# EAGLE design TheSchematic (EAGLE 9.3.0)
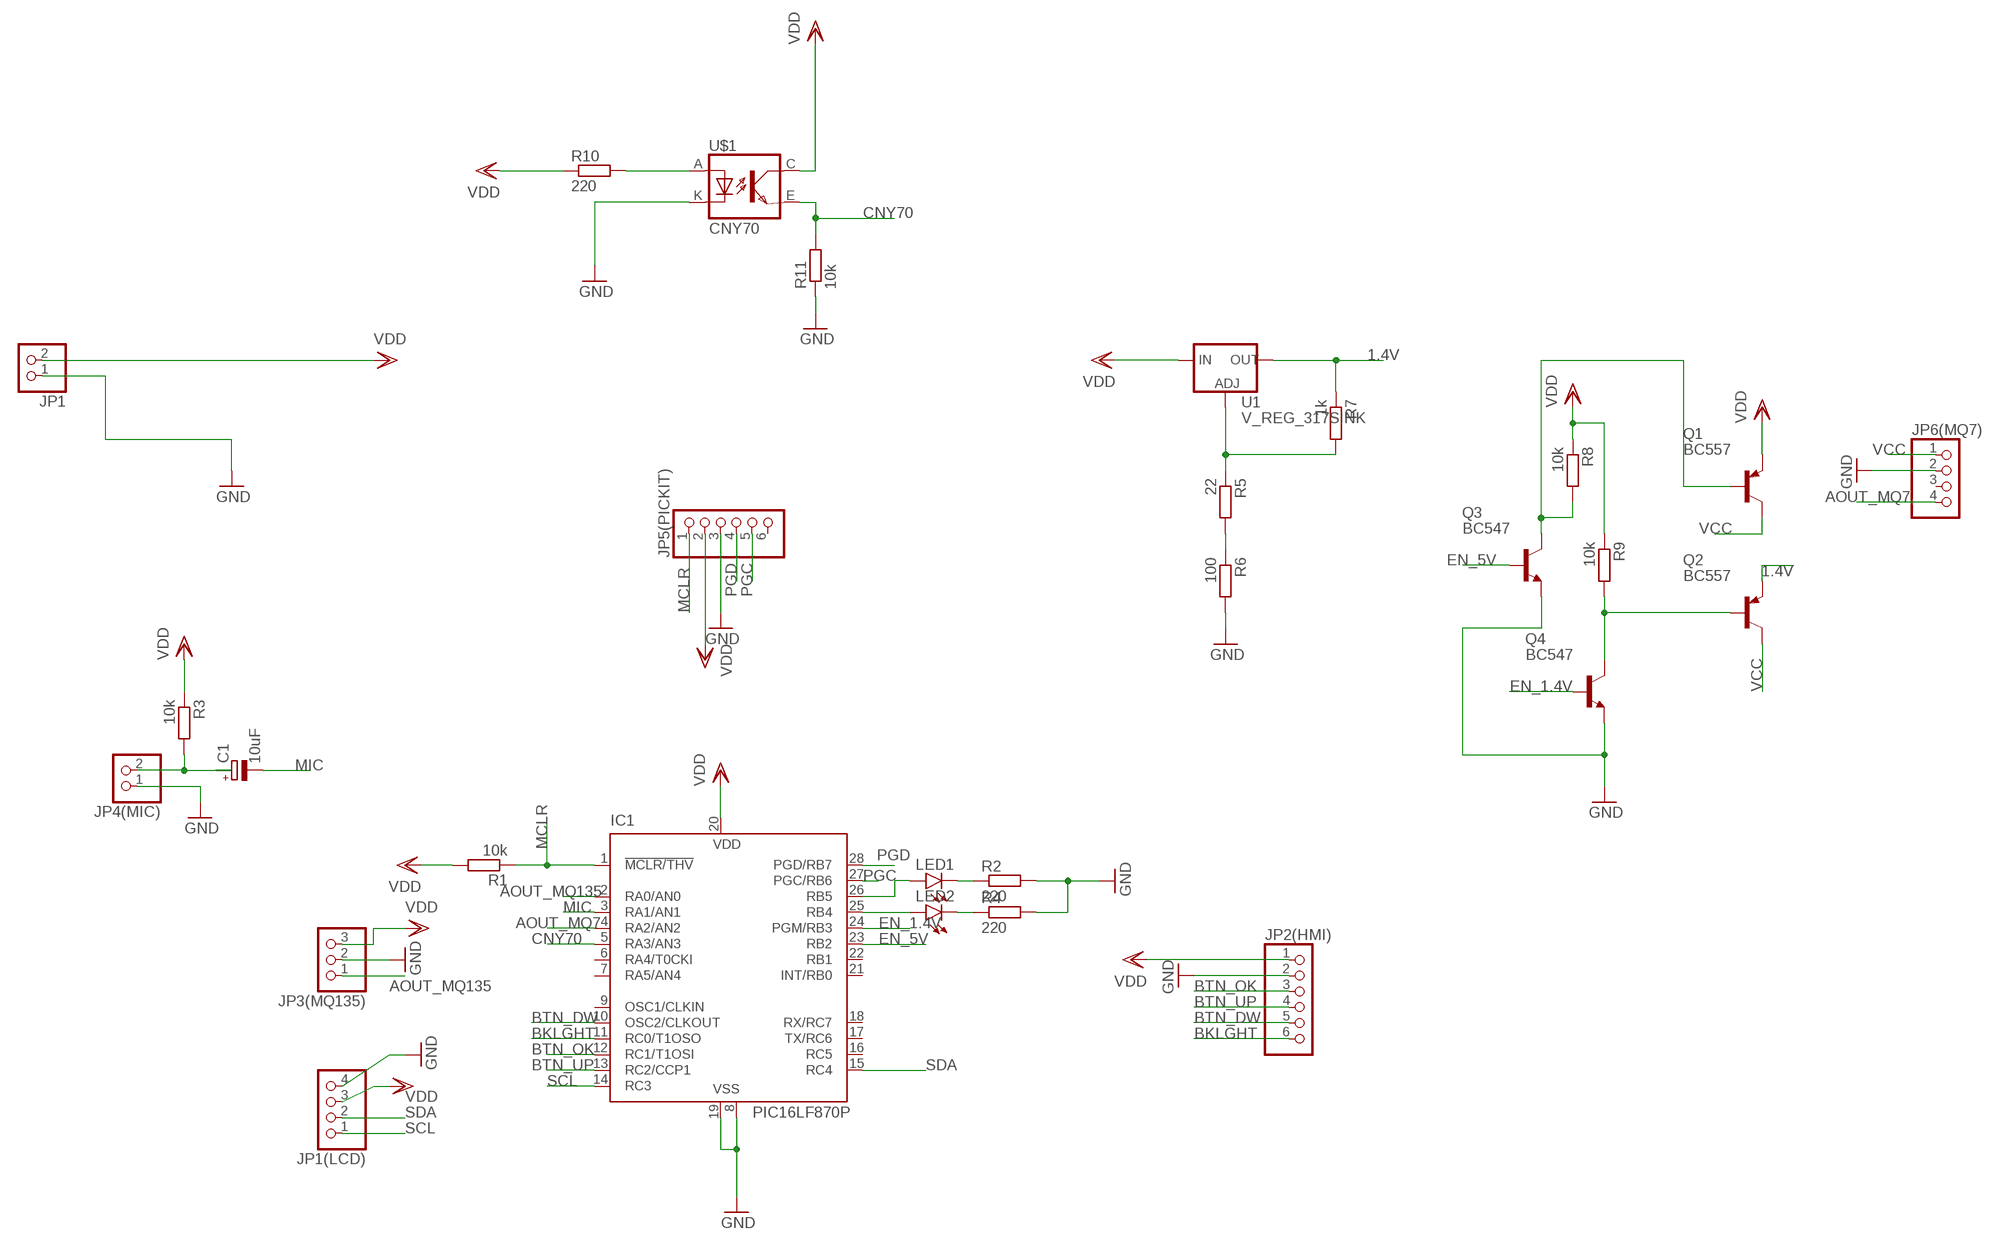
[diagram p0: schematic, sheet 1]

## Parts
C1  10uF  CPOL-EUE1.8-4  [E1,8-4]
IC1  PIC16LF870P  [DIL28-3]
JP1  PINHD-1X2  [1X02]
JP1(LCD)  PINHD-1X4  [1X04]
JP2(HMI)  PINHD-1X6  [1X06]
JP3(MQ135)  PINHD-1X3  [1X03]
JP4(MIC)  PINHD-1X2  [1X02]
JP5(PICKIT)  PINHD-1X6  [1X06]
JP6(MQ7)  PINHD-1X4  [1X04]
LED1  LED5MM  [LED5MM]
LED2  LED5MM  [LED5MM]
Q1  BC557  [TO92-EBC]
Q2  BC557  [TO92-EBC]
Q3  BC547  [TO92]
Q4  BC547  [TO92]
R1  10k  R-EU_0204/7  [0204/7]
R2  220  R-EU_0207/10  [0207/10]
R3  10k  R-EU_0204/7  [0204/7]
R4  220  R-EU_0207/10  [0207/10]
R5  22  R-EU_0204/7  [0204/7]
R6  100  R-EU_0204/7  [0204/7]
R7  1k  R-EU_0204/7  [0204/7]
R8  10k  R-EU_0204/7  [0204/7]
R9  10k  R-EU_0204/7  [0204/7]
R10  220  R-EU_0207/10  [0207/10]
R11  10k  R-EU_0207/10  [0207/10]
U1  V_REG_317SINK  [TO220-ADJ]
U$1  CNY70  [4]

## Nets
1.4V: Q2.E R7.1 U1.OUT
AOUT_MQ7: IC1.4(RA2/AN2) JP6(MQ7).4
AOUT_MQ135: IC1.2(RA0/AN0) JP3(MQ135).1
BKLGHT: IC1.11(RC0/T1OSO) JP2(HMI).6
BTN_DW: IC1.10(OSC2/CLKOUT) JP2(HMI).5
BTN_OK: IC1.12(RC1/T1OSI) JP2(HMI).3
BTN_UP: IC1.13(RC2/CCP1) JP2(HMI).4
CNY70: IC1.5(RA3/AN3) R11.2 U$1.E(EMI)
EN_1.4V: IC1.24(PGM/RB3) Q4.2(B)
EN_5V: IC1.23(RB2) Q3.2(B)
GND: IC1.8(VSS) IC1.19(VSS) JP1(LCD).4 JP1.1 JP2(HMI).2 JP3(MQ135).2 JP4(MIC).1 JP5(PICKIT).3 JP6(MQ7).2 Q3.1(E) Q4.1(E) R2.2 R4.2 R6.2 R11.1 U$1.K(C)
MCLR: IC1.1(!MCLR/THV) JP5(PICKIT).1 R1.1
MIC: C1.- IC1.3(RA1/AN1)
N$1: R5.1 R7.2 U1.ADJ
N$2: IC1.26(RB5) LED1.A
N$3: LED1.K(C) R2.1
N$4: C1.+ JP4(MIC).2 R3.2
N$5: IC1.25(RB4) LED2.A
N$6: LED2.K(C) R4.1
N$7: R5.2 R6.1
N$8: R10.2 U$1.A
N$9: Q1.B Q3.3(C) R8.2
N$10: Q2.B Q4.3(C) R9.2
PGC: IC1.27(PGC/RB6) JP5(PICKIT).5
PGD: IC1.28(PGD/RB7) JP5(PICKIT).4
SCL: IC1.14(RC3) JP1(LCD).1
SDA: IC1.15(RC4) JP1(LCD).2
VCC: JP6(MQ7).1 Q1.C Q2.C
VDD: IC1.20(VDD) JP1(LCD).3 JP1.2 JP2(HMI).1 JP3(MQ135).3 JP5(PICKIT).2 Q1.E R1.2 R3.1 R8.1 R9.1 R10.1 U1.IN U$1.C(COL)
Unconnected: IC1.6(RA4/T0CKI) IC1.7(RA5/AN4) IC1.9(OSC1/CLKIN) IC1.16(RC5) IC1.17(TX/RC6) IC1.18(RX/RC7) IC1.21(INT/RB0) IC1.22(RB1) JP5(PICKIT).6 JP6(MQ7).3

## Library data of the parts
C1 = rcl:CPOL-EU: POLARIZED CAPACITOR, European symbol; SPICEPREFIX: C
IC1 = microchip:PIC16*870: MICROCONTROLLER flash type; MF: MICROCHIP; MPN: PIC16LF870-I/SP; OC_FARNELL: 1579594; OC_NEWARK: 69K7641
JP1 JP4(MIC) = pinhead:PINHD-1X2: PIN HEADER
JP1(LCD) JP6(MQ7) = pinhead:PINHD-1X4: PIN HEADER
JP2(HMI) JP5(PICKIT) = pinhead:PINHD-1X6: PIN HEADER
JP3(MQ135) = pinhead:PINHD-1X3: PIN HEADER
LED1 LED2 = led:LED: LED OSRAM: - CHIPLED LG R971, LG N971, LY N971, LG Q971, LY Q971, LO R971, LY R971 LH N974, LH R974 LS Q976, LO Q976, LY Q976 LO Q996 - Hyper CHIPLED LW Q18S LB Q993, LB Q99A, LB R99A - SideLED LS A670, LO A670, LY A670, LG A670, LP A670 LB A673, LV A673, LT A673, LW A673 LH A674 LY A675 LS A676, LA A676, LO A676, LY A676, LW A676 LS A679, LY A679, LG A679 - Hyper Micro SIDELED® LS Y876, LA Y876, LO Y876, LY Y876 LT Y87S - SmartLED LW L88C, LW L88S LB L89C, LB L89S, LG L890 LS L89K, LO L89K, LY L89K LS L896, LA L896, LO L896, LY L896 - TOPLED LS T670, LO T670, LY T670, LG T670, LP T670 LSG T670, LSP T670, LSY T670, LOP T670, LYG T670 LG T671, LOG T671, LSG T671 LB T673, LV T673, LT T673, LW T673 LH T674 LS T676, LA T676, LO T676, LY T676, LB T676, LH T676, LSB T676, LW T676 LB T67C, LV T67C, LT T67C, LS T67K, LO T67K, LY T67K, LW E67C LS E67B, LA E67B, LO E67B, LY E67B, LB E67C, LV E67C, LT E67C LW T67C LS T679, LY T679, LG T679 LS T770, LO T770, LY T770, LG T770, LP T770 LB T773, LV T773, LT T773, LW T773 LH T774 LS E675, LA E675, LY E675, LS T675 LS T776, LA T776, LO T776, LY T776, LB T776 LHGB T686 LT T68C, LB T68C - Hyper Mini TOPLED® LB M676 - Mini TOPLED Santana® LG M470 LS M47K, LO M47K, LY M47K Source: http://www.osram.convergy.de LUXEON: - LUMILED® LXK2-PW12-R00, LXK2-PW12-S00, LXK2-PW14-U00, LXK2-PW14-V00 LXK2-PM12-R00, LXK2-PM12-S00, LXK2-PM14-U00 LXK2-PE12-Q00, LXK2-PE12-R00, LXK2-PE12-S00, LXK2-PE14-T00, LXK2-PE14-U00 LXK2-PB12-K00, LXK2-PB12-L00, LXK2-PB12-M00, LXK2-PB14-N00, LXK2-PB14-P00, LXK2-PB14-Q00 LXK2-PR12-L00, LXK2-PR12-M00, LXK2-PR14-Q00, LXK2-PR14-R00 LXK2-PD12-Q00, LXK2-PD12-R00, LXK2-PD12-S00 LXK2-PH12-R00, LXK2-PH12-S00 LXK2-PL12-P00, LXK2-PL12-Q00, LXK2-PL12-R00 Source: www.luxeon.com KINGBRIGHT: KA-3528ASYC Source: www.kingbright.com
Q1 Q2 = transistor-pnp:BC557*: PNP Transistror
Q3 Q4 = transistor-npn:BC547*: NPN Transistor
R1-R11 = rcl:R-EU_: RESISTOR, European symbol; SPICEPREFIX: R
U1 = SparkFun-IC-Power:V_REG_317: Voltage Regulator Standard LM317 adjustable voltage regulator. AOI (Adjust Output Input). Google 'LM317 Calculator' for easy to use app to get the two resistor values needed. 240/720 for 5V output. 240/390 for 3.3V output. Spark Fun Electronics SKU : COM-00527
U$1 = cny70:CNY70

## Board
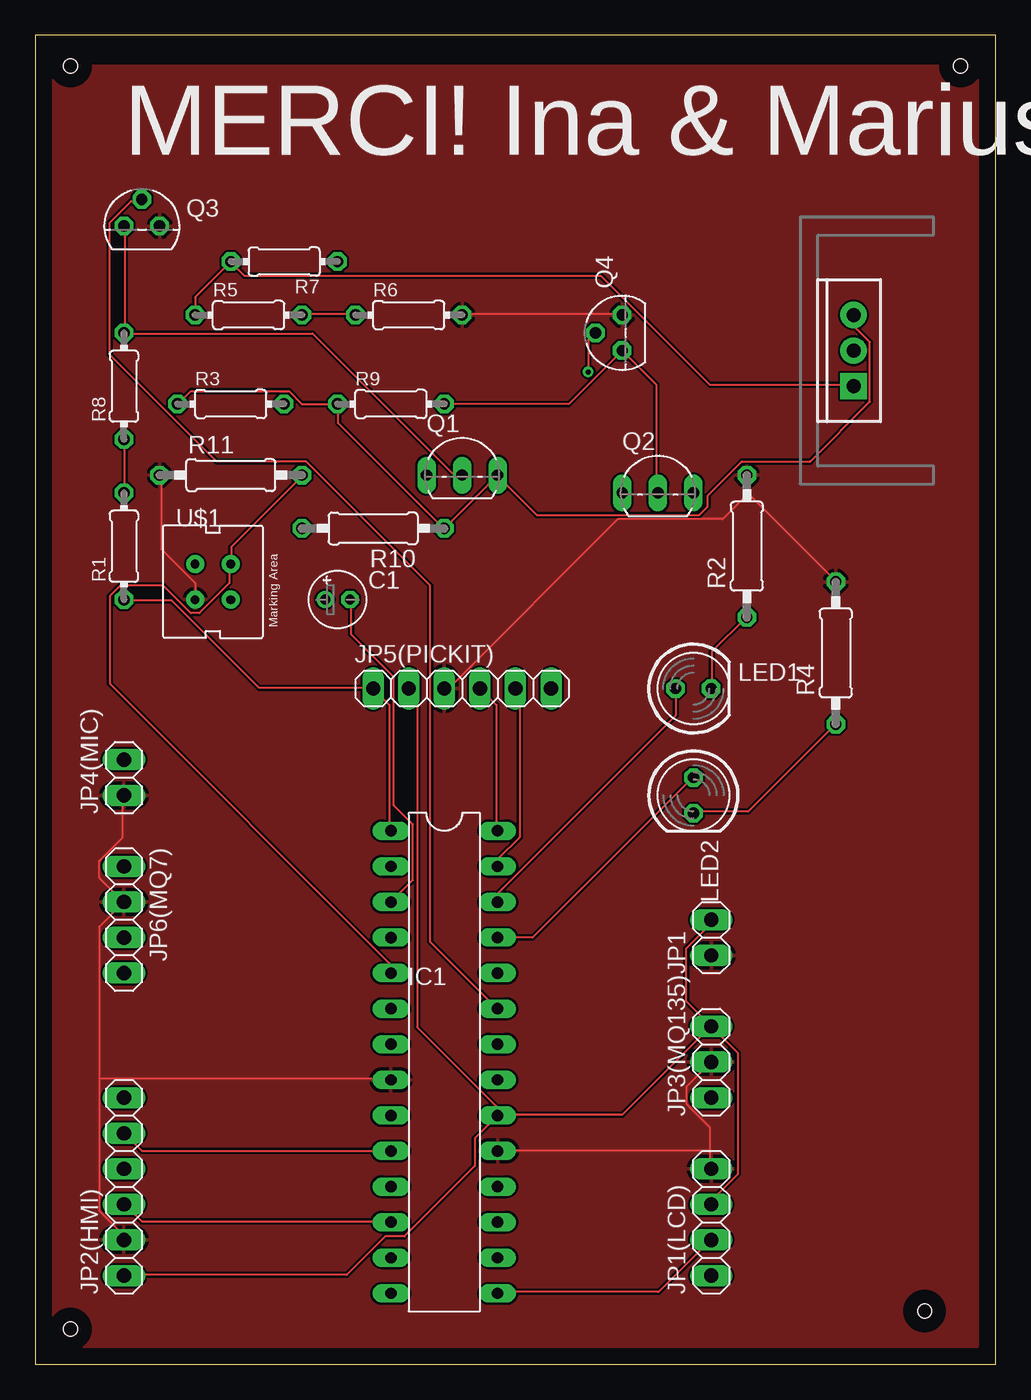
[diagram p1: board, top side]
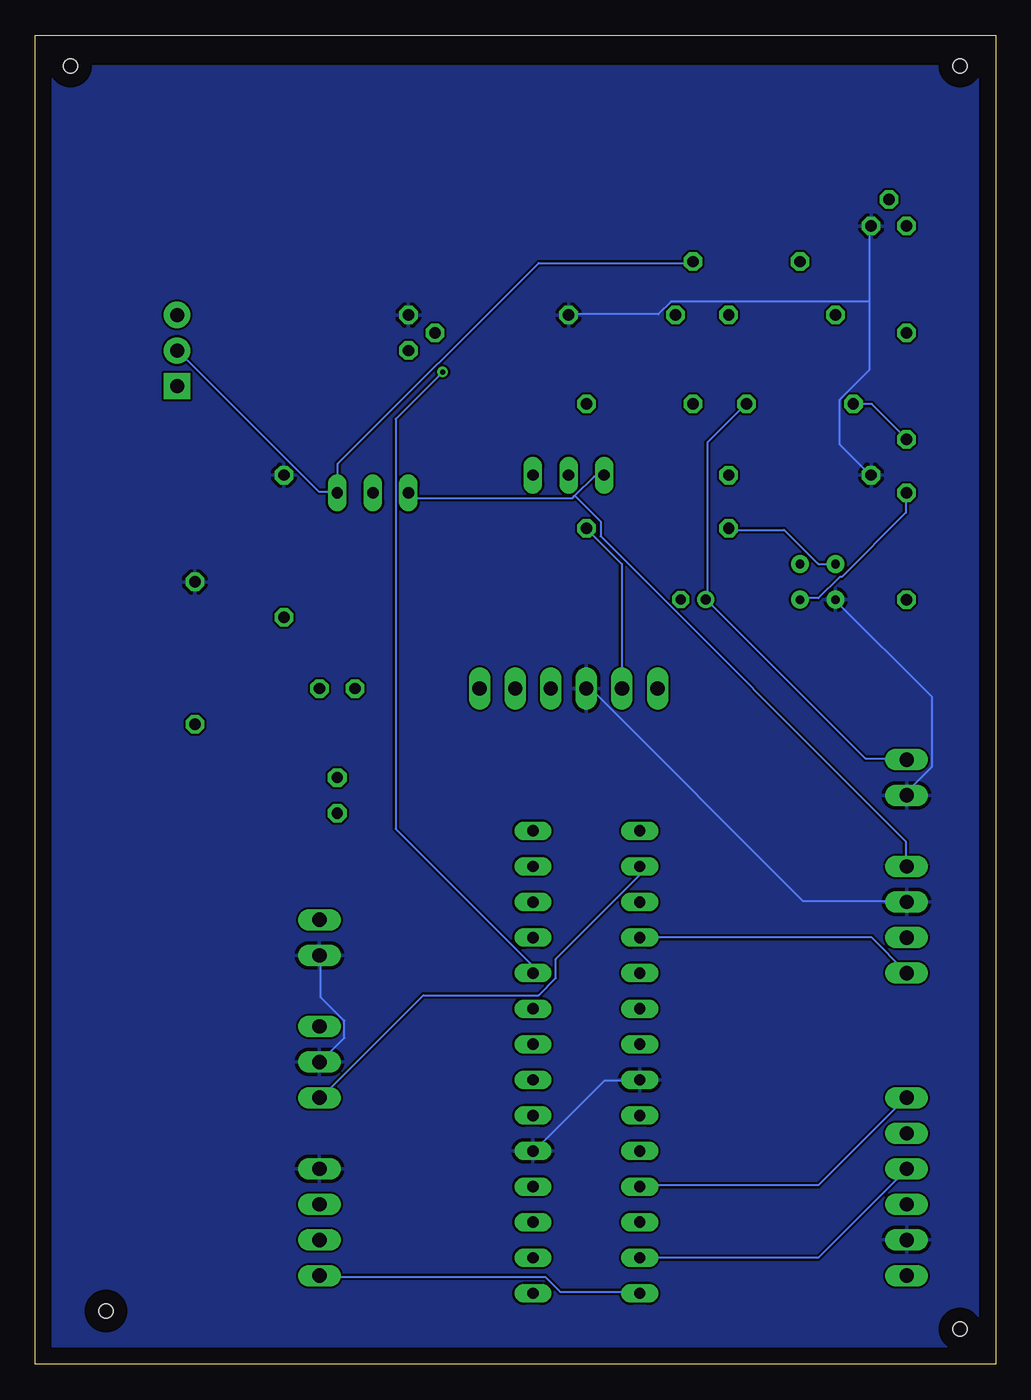
[diagram p2: board, bottom side, seen from below]

Size 68.56 x 94.92 mm. Coordinates in mm from the lower left corner, seen from the top.
Outline: 0,0 68.56,0 68.56,94.92 0,94.92 0,0
Copper layers (1*16): Top 0.035mm / dielectric 1.5mm / Bottom 0.035mm
Design rules "default": minimum track width 6mil, minimum drill 0.35mm, track to track 6mil, track to pad 6mil, pad to pad 6mil, via to via 6mil, smd to smd 6mil, copper to edge 40mil, drill to drill 6mil, minimum pad ring 10mil, minimum via ring 8mil, stop-mask expansion 4mil, vias tented up to drill 0mil, thermal gap 10mil
Holes 1 mm at 63.5,3.81 66.04,92.71 2.54,92.71 2.54,2.54

### Footprints (pad centres in the part's own frame; a part is rotated, then mirrored left to right if it is on the bottom)
E1,8-4 = drill 0.711 pad 1.168: + -0.889,0 | drill 0.711 pad 1.168 octagon: - 0.889,0
DIL28-3 = drill 0.813 long: 1 -16.51,-3.81; 2 -13.97,-3.81; 3 -11.43,-3.81; 4 -8.89,-3.81; 5 -6.35,-3.81; 6 -3.81,-3.81; 7 -1.27,-3.81; 8 1.27,-3.81; 9 3.81,-3.81; 10 6.35,-3.81; 11 8.89,-3.81; 12 11.43,-3.81; 13 13.97,-3.81; 14 16.51,-3.81; 15 16.51,3.81; 16 13.97,3.81; 17 11.43,3.81; 18 8.89,3.81; 19 6.35,3.81; 20 3.81,3.81; 21 1.27,3.81; 22 -1.27,3.81; 23 -3.81,3.81; 24 -6.35,3.81; 25 -8.89,3.81; 26 -11.43,3.81; 27 -13.97,3.81; 28 -16.51,3.81
1X02 = drill 1.016 long: 1 -1.27,0; 2 1.27,0
1X04 = drill 1.016 long: 1 -3.81,0; 2 -1.27,0; 3 1.27,0; 4 3.81,0
1X06 = drill 1.016 long: 1 -6.35,0; 2 -3.81,0; 3 -1.27,0; 4 1.27,0; 5 3.81,0; 6 6.35,0
1X03 = drill 1.016 long: 1 -2.54,0; 2 0,0; 3 2.54,0
LED5MM = drill 0.813 octagon: A -1.27,0; K 1.27,0
TO92-EBC = drill 0.813 long: B 0,-1.27; C -2.54,-1.27; E 2.54,-1.27
TO92 = drill 0.813 octagon: 1 1.27,0; 2 0,1.905; 3 -1.27,0
0204/7 = drill 0.813 octagon: 1 -3.81,0; 2 3.81,0
0207/10 = drill 0.813 octagon: 1 -5.08,0; 2 5.08,0
TO220-ADJ = drill 1 pad 1.88 square: ADJ -2.54,0 | drill 1 pad 1.88: IN 2.54,0; OUT 0,0
4 = drill 0.61 pad 1.27: A -1.27,1.27; C 1.27,-1.27; E 1.27,1.27; K -1.27,-1.27

### Placement (x,y rotation side)
C1  21.59,54.61 0 top
IC1  29.21,21.59 270 top
JP1  48.26,30.48 90 top
JP1(LCD)  48.26,10.16 90 top
JP2(HMI)  6.35,12.7 90 top
JP3(MQ135)  48.26,21.59 90 top
JP4(MIC)  6.35,41.91 90 top
JP5(PICKIT)  30.48,48.26 0 top
JP6(MQ7)  6.35,31.75 270 top
LED1  46.99,48.26 0 top
LED2  46.99,40.64 270 top
Q1  30.48,64.77 0 top
Q2  44.45,63.5 0 top
Q3  7.62,81.28 0 top
Q4  41.91,73.66 90 top
R1  6.35,58.42 90 top
R2  50.8,58.42 90 top
R3  13.97,68.58 0 top
R4  57.15,50.8 90 top
R5  15.24,74.93 0 top
R6  26.67,74.93 0 top
R7  17.78,78.74 180 top
R8  6.35,69.85 90 top
R9  25.4,68.58 0 top
R10  24.13,59.69 180 top
R11  13.97,63.5 0 top
U1  58.42,72.39 90 top
U$1  12.7,55.88 0 top

### Tracks (layer width: path | path; a pad name or v marks a point on that pad's centre or on a via)
1.4V
  Bottom 0.152: U1.OUT 58.37,72.39 48.31,62.33 47.09,62.33 Q2.E 46.94,62.33 46.94,64.31 32.61,78.64 21.64,78.64 R7.1
AOUT_MQ7
  Bottom 0.152: IC1.4 8.84,30.48 6.4,28.04 JP6(MQ7).4
AOUT_MQ135
  Bottom 0.152: IC1.2 25.45,35.51 25.45,34.9 31.39,28.96 31.39,27.58 32.61,26.36 40.84,26.36 48.16,19.05 JP3(MQ135).1
BKLGHT
  Bottom 0.152: IC1.11 25.3,12.8 12.65,12.8 6.4,19.05 JP2(HMI).6
BTN_DW
  Top 0.152: IC1.10 7.62,15.24 JP2(HMI).5
BTN_OK
  Top 0.152: IC1.12 25.3,10.21 7.62,10.21 6.4,11.43 JP2(HMI).3
BTN_UP
  Bottom 0.152: IC1.13 12.65,7.62 6.4,13.87 JP2(HMI).4
CNY70
  Top 0.152: R11.2 19.05,63.4 14.02,58.37 14.02,57.15 U$1.E 13.87,57.15 13.87,55.78 11.73,53.65 11.12,53.65 9.14,55.63 6.1,55.63 5.33,54.86 5.33,48.62 25.3,28.65 25.3,28.04 IC1.5
EN_1.4V  (via drill 0.35)
  Top 0.152: v39.47,70.87 39.47,73.15 39.93,73.61 Q4.2
  Bottom 0.152: v39.47,70.87 42.82,67.51 42.82,38.25 33.07,28.5 33.07,28.04 IC1.24
EN_5V
  Top 0.152: Q3.2 7.62,83.06 6.86,83.06 5.33,81.53 5.33,72.08 12.95,64.47 19.36,64.47 28.19,55.63 28.19,30.18 32.92,25.45 IC1.23
GND
  Top 0.152: 50.9,62.18 50.9,63.4 R2.2 | 50.9,62.18 57.15,55.93 R4.2 | 50.9,62.18 49.07,60.35 41.6,60.35 29.57,48.31 29.26,48.31 JP5(PICKIT).3 | 48.16,15.24 48.16,16.92 46.48,18.59 46.48,19.81 JP3(MQ135).2 | 48.16,15.24 48.16,14.02 JP1(LCD).4 | 48.16,15.24 IC1.19 | 4.57,20.42 4.57,31.24 JP6(MQ7).2 6.25,33.07 4.57,34.75 4.57,35.97 6.25,37.64 6.25,40.54 JP4(MIC).1 | 4.57,20.42 4.57,10.97 6.25,9.3 6.25,8.99 JP2(HMI).2 | R6.2 30.48,74.98 41.91,74.98 Q4.1 | U$1.K 11.43,55.78 8.99,58.22 8.99,63.4 R11.1 | 4.57,20.42 25.3,20.42 IC1.8
  Bottom 0.152: IC1.8 25.45,20.27 27.89,20.27 32.92,15.24 IC1.19 | JP1.1 48.16,29.11 48.16,26.21 46.48,24.54 46.48,23.32 48.16,21.64 JP3(MQ135).2 | 8.99,75.89 8.99,71.02 11.12,68.89 11.12,65.68 8.99,63.55 R11.1 | 8.99,75.89 8.99,81.23 Q3.1 | 8.99,75.89 23.16,75.89 24.08,74.98 30.48,74.98 R6.2 | JP4(MIC).1 6.25,40.69 6.25,41 4.57,42.67 4.57,47.7 11.43,54.56 U$1.K | JP5(PICKIT).3 29.11,48.16 28.8,48.16 13.72,33.07 6.4,33.07 JP6(MQ7).2
  pour Top: 1.27,92.71 1.27,1.27 67.31,1.27 67.31,92.71
  pour Bottom: 1.27,92.71 1.27,1.27 67.31,1.27 67.31,92.71
MCLR
  Top 0.152: IC1.1 25.3,38.1 25.3,47.09 JP5(PICKIT).1 24.08,48.31 16,48.31 9.75,54.56 6.4,54.56 R1.1
MIC
  Top 0.152: IC1.3 26.98,34.59 26.98,38.56 25.6,39.93 25.6,49.07 22.55,52.12 22.55,54.56 C1.-
N$1
  Top 0.152: R5.1 11.43,76.2 R7.2 14.02,78.64 14.94,77.72 40.39,77.72 48.16,69.95 58.37,69.95 U1.ADJ
N$2
  Top 0.152: LED1.A 45.72,46.33 33.07,33.68 33.07,33.07 IC1.26
N$3
  Top 0.152: LED1.K 48.31,48.31 48.31,50.9 50.75,53.34 R2.1
N$4
  Bottom 0.152: R3.2 17.83,68.58 20.57,65.84 20.57,54.71 C1.+ 20.57,54.56 9.3,43.28 6.4,43.28 JP4(MIC).2
N$5
  Top 0.152: IC1.25 35.51,30.48 46.94,41.91 LED2.A
N$6
  Top 0.152: R4.1 50.9,39.47 47.09,39.47 LED2.K
N$7
  Top 0.152: R5.2 19.05,74.98 22.86,74.98 R6.1
N$8
  Bottom 0.152: U$1.A 12.65,57.15 15.09,59.59 19.05,59.59 R10.2
N$9
  Top 0.152: Q3.3 6.4,81.23 6.4,73.76 R8.2 6.4,73.61 19.81,73.61 29.87,63.55 30.48,63.55 Q1.B
N$10
  Top 0.152: Q2.B 44.35,62.33 44.35,69.95 Q4.3 38.1,68.58 R9.2
PGC
  Top 0.152: IC1.27 33.07,35.66 33.07,36.12 34.59,37.64 34.59,47.85 34.29,48.16 JP5(PICKIT).5
PGD
  Top 0.152: JP5(PICKIT).4 32.92,47.09 32.92,38.1 IC1.28
SCL
  Bottom 0.152: IC1.14 25.45,5.18 31.09,5.18 32.16,6.25 48.16,6.25 JP1(LCD).1
SDA
  Top 0.152: IC1.15 33.07,5.18 44.5,5.18 48.16,8.84 JP1(LCD).2
VCC
  Bottom 0.152: 30.02,62.03 30.18,61.87 41.6,61.87 41.91,62.18 Q2.C | 30.02,62.03 28.65,63.4 28.04,63.4 Q1.C | 30.02,62.03 28.19,60.2 28.19,59.13 6.4,37.34 6.4,35.66 JP6(MQ7).1
VDD
  Top 0.152: IC1.20 33.07,17.83 41.91,17.83 48.16,24.08 JP3(MQ135).3 | IC1.20 31.39,16.15 31.39,14.17 26.36,9.14 24.99,9.14 22.25,6.4 6.4,6.4 JP2(HMI).1 | JP3(MQ135).3 50.14,22.25 50.14,13.56 48.31,11.73 48.31,11.43 JP1(LCD).3 | JP3(MQ135).3 46.48,25.91 46.48,29.72 48.16,31.39 48.16,31.7 JP1.2 | R8.1 6.4,65.99 6.4,62.33 R1.2 | R3.1 10.21,68.58 11.12,69.49 18.14,69.49 19.05,68.58 R9.1 21.64,68.58 21.64,67.21 29.11,59.74 R10.1 Q1.E 33.07,63.4 35.81,60.66 47.4,60.66 48.01,61.27 48.01,62.03 50.44,64.47 55.32,64.47 59.59,68.73 59.59,73 58.52,74.07 58.52,74.83 U1.IN | IC1.20 32.92,17.83 32.92,18.44 27.28,24.08 27.28,47.55 26.67,48.16 JP5(PICKIT).2
  Bottom 0.152: U$1.C 13.87,54.71 12.65,54.71 11.12,56.24 10.97,56.24 6.4,60.81 6.4,62.18 R1.2 | R3.1 8.84,68.58 6.4,66.14 R8.1 | JP5(PICKIT).2 26.67,57.15 R10.1

### Text on the board
tNames: MERCI! Ina & Marius